# EAGLE schematic BoosterPack-Template-revA (EAGLE 6.4)
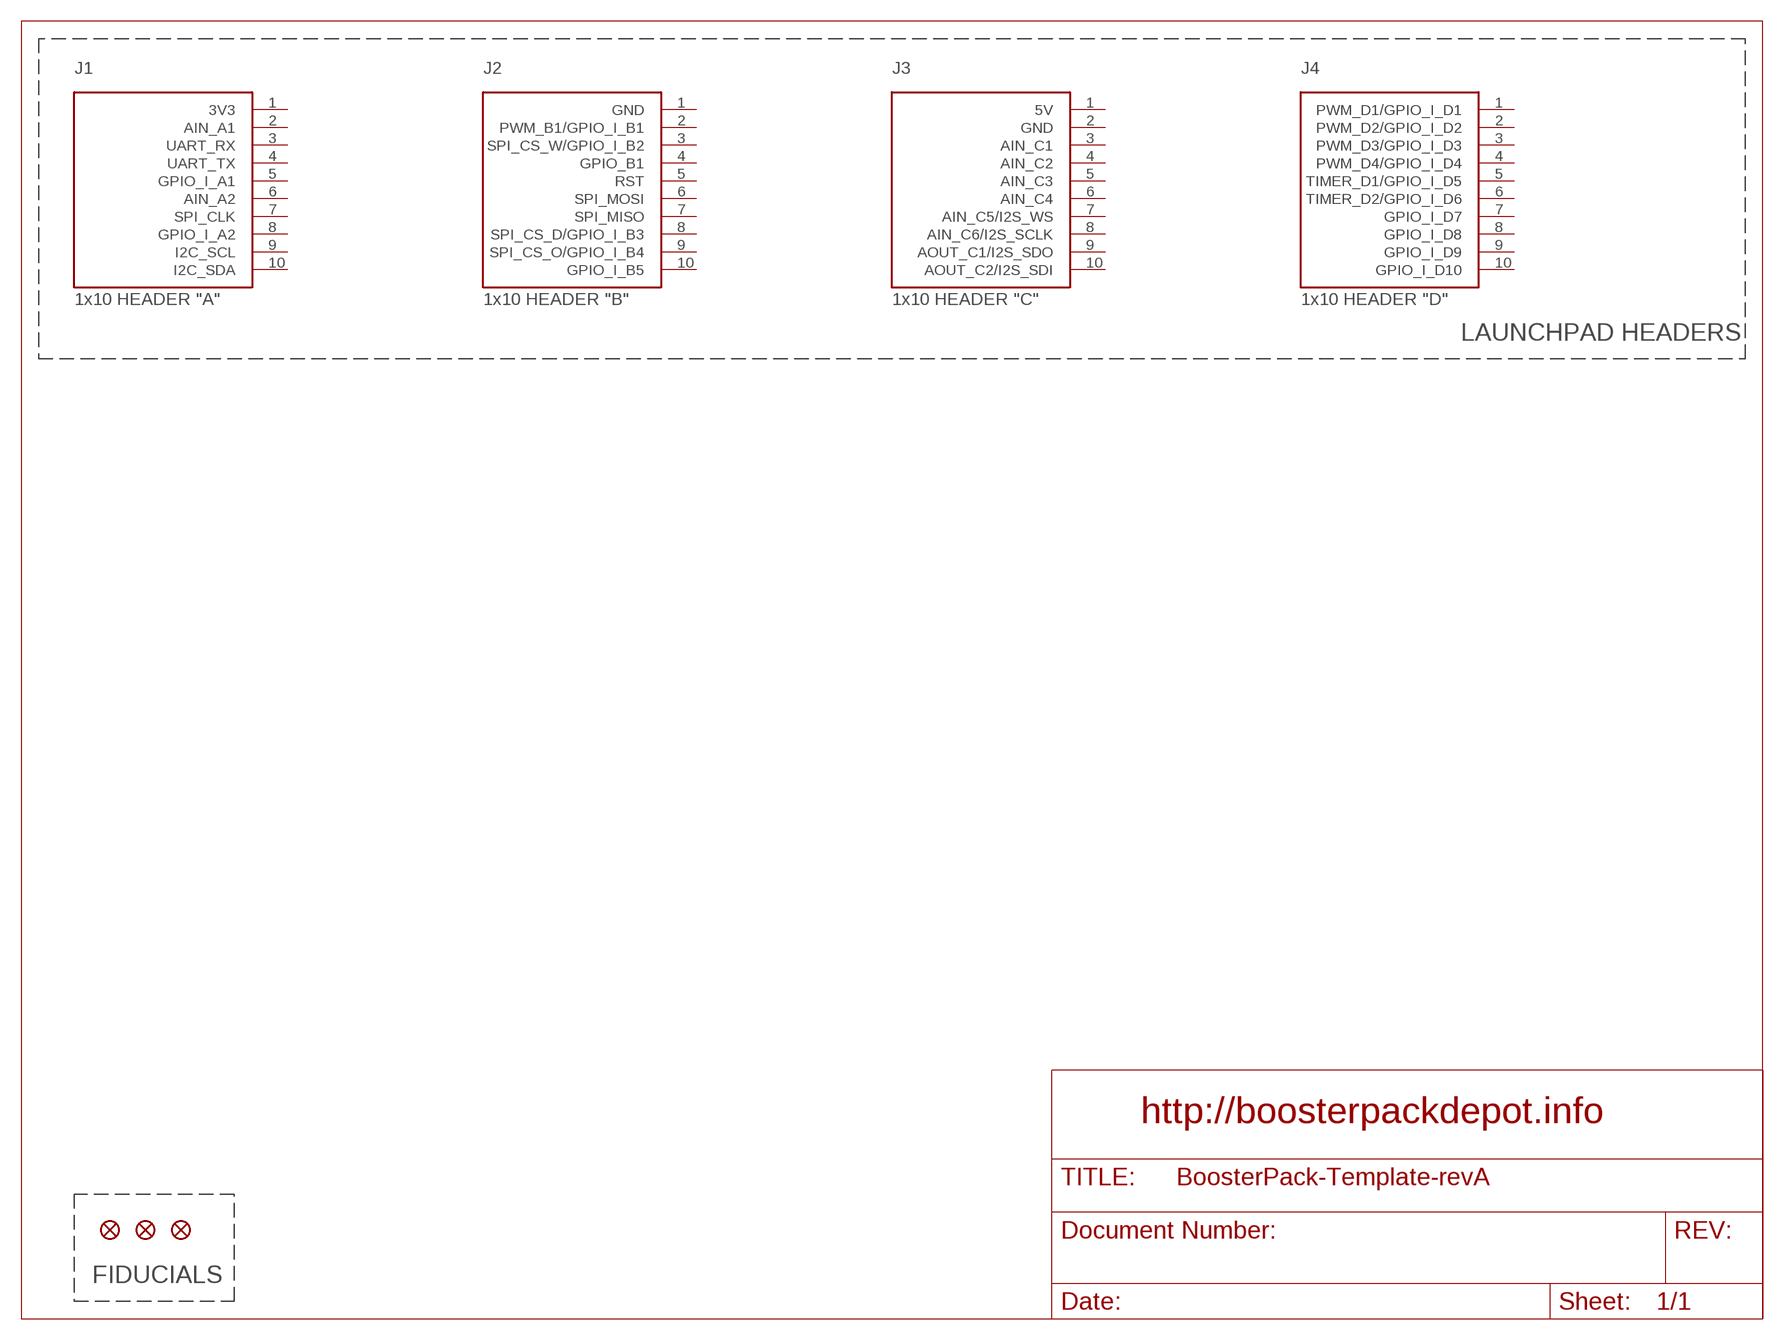
[diagram p0: schematic, sheet 1]

## Parts
FID1  FIDUCIAL  [FIDUCIAL_L10]
FID2  FIDUCIAL  [FIDUCIAL_L10]
FID3  FIDUCIAL  [FIDUCIAL_L10]
J1  1x10 HEADER "A"  HEADER-1X10-J1  [1X10]
J2  1x10 HEADER "B"  HEADER-1X10-J2  [1X10]
J3  1x10 HEADER "C"  HEADER-1X10-J3  [1X10]
J4  1x10 HEADER "D"  HEADER-1X10-J4  [1X10]
Unconnected: J1.1(3V3) J1.2(AIN_A1) J1.3(UART_RX) J1.4(UART_TX) J1.5(GPIO_I_A1) J1.6(AIN_A2) J1.7(SPI_CLK) J1.8(GPIO_I_A2) J1.9(I2C_SCL) J1.10(I2C_SDA) J2.1(GND) J2.2(PWM_B1/GPIO_I_B1) J2.3(SPI_CS_W/GPIO_I_B2) J2.4(GPIO_B1) J2.5(RST) J2.6(SPI_MOSI) J2.7(SPI_MISO) J2.8(SPI_CS_D/GPIO_I_B3) J2.9(SPI_CS_O/GPIO_I_B4) J2.10(GPIO_I_B5) J3.1(5V) J3.2(GND) J3.3(AIN_C1) J3.4(AIN_C2) J3.5(AIN_C3) J3.6(AIN_C4) J3.7(AIN_C5/I2S_WS) J3.8(AIN_C6/I2S_SCLK) J3.9(AOUT_C1/I2S_SDO) J3.10(AOUT_C2/I2S_SDI) J4.1(PWM_D1/GPIO_I_D1) J4.2(PWM_D2/GPIO_I_D2) J4.3(PWM_D3/GPIO_I_D3) J4.4(PWM_D4/GPIO_I_D4) J4.5(TIMER_D1/GPIO_I_D5) J4.6(TIMER_D2/GPIO_I_D6) J4.7(GPIO_I_D7) J4.8(GPIO_I_D8) J4.9(GPIO_I_D9) J4.10(GPIO_I_D10)

## Notes on the sheet
- LAUNCHPAD HEADERS
- http://boosterpackdepot.info
- FIDUCIALS

## Library data of the parts
FID1-FID3 = CCo-Boost:FIDUCIAL: Fiducial Alignment Points Various fiducial points for machine vision alignment.
J1 = CCo-Boost:HEADER-1X10-J1: 1x10 BoosterPack Header J1 This 1x10 header matches the pinout of J1 header of the BoosterPack Pinout Standard.
J2 = CCo-Boost:HEADER-1X10-J2: 1x10 BoosterPack Header J2 This 1x10 header matches the pinout of J2 header of the BoosterPack Pinout Standard.
J3 = CCo-Boost:HEADER-1X10-J3: 1x10 BoosterPack Header J3 This 1x10 header matches the pinout of J3 header of the BoosterPack Pinout Standard.
J4 = CCo-Boost:HEADER-1X10-J4: 1x10 BoosterPack Header J4 This 1x10 header matches the pinout of J4 header of the BoosterPack Pinout Standard.